# EAGLE design Car cover Main1 (EAGLE 7.6.0)
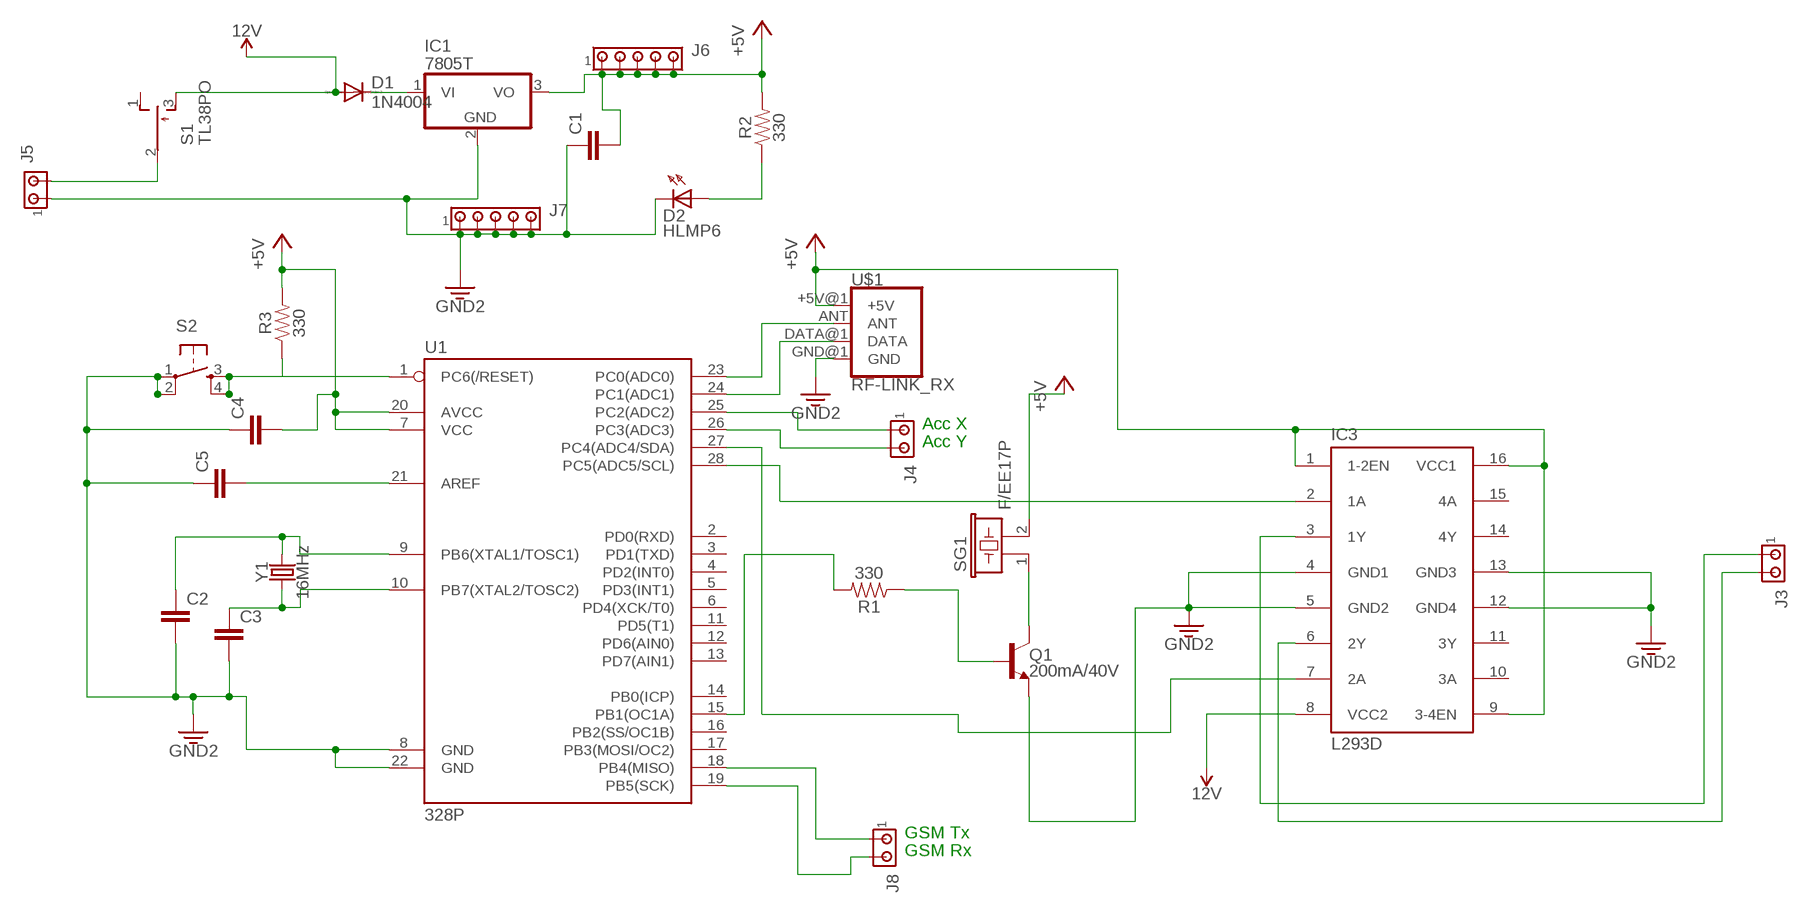
[diagram p0: schematic, sheet 1]

## Parts
C1  C5/2.5  [C5B2.5]
C2  C5/2.5  [C5B2.5]
C3  C5/2.5  [C5B2.5]
C4  C5/2.5  [C5B2.5]
C5  C5/2.5  [C5B2.5]
D1  1N4004  [DO41-10]
D2  HLMP6  [HLMP6]
IC1  7805T  [TO220H]
IC3  L293D  [DIL16]
J3  MTA02-156  [1X2MTA]
J4  MTA02-156  [1X2MTA]
J5  MTA02-156  [1X2MTA]
J6  MTA05-100  [10X05MTA]
J7  MTA05-100  [10X05MTA]
J8  MTA02-156  [1X2MTA]
Q1  200mA/40V  TRANS_NPN-2N3904  [TO-92]
R1  330  330OHM-HORIZ-1/10W-5%  [AXIAL-0.3]
R2  330  330OHM-HORIZ-1/10W-5%  [AXIAL-0.3]
R3  330  330OHM-HORIZ-1/10W-5%  [AXIAL-0.3]
S1  TL38PO  [TL3XPO]
S2  TAC_SWITCHPTH  [TACTILE-PTH]
SG1  F/EE17P  [F/EE17P]
U1  328P  ATMEGA328P_PDIP  [DIP28]
U$1  RF-LINK_RX  [RF-LINK_RX]
Y1  16MHz  CRYSTAL-16MHZPTH-HC49US  [HC49US]

## Nets
3.3V: C1.1 C2.2 C3.2 C4.1 C5.1 D2.K IC1.2(GND) IC3.4(GND1) IC3.5(GND2) IC3.12(GND4) IC3.13(GND3) J5.1 J7.1 J7.2 J7.3 J7.4 J7.5 Q1.1(E) S2.1 S2.2 U1.8(GND) U1.22(GND) U$1.GND@1(GND) ; supply symbol labelled GND2
12V: D1.A IC3.8(VCC2) S1.3(S)
+5V: C1.2 C4.2 IC1.3(VO) IC3.1(1-2EN) IC3.9(3-4EN) IC3.16(VCC1) J6.1 J6.2 J6.3 J6.4 J6.5 R2.P$2 R3.P$2 SG1.2 U1.7(VCC) U1.20(AVCC) U$1.+5V@1(+5V)
N$1: U1.23(PC0(ADC0)) U$1.ANT
N$2: J4.1 U1.25(PC2(ADC2))
N$3: J4.2 U1.26(PC3(ADC3))
N$4: J8.1 U1.18(PB4(MISO))
N$5: J8.2 U1.19(PB5(SCK))
N$6: IC3.2(1A) U1.28(PC5(ADC5/SCL))
N$7: D2.A R2.P$1
N$8: Q1.2(B) R1.P$1
N$9: IC3.7(2A) U1.27(PC4(ADC4/SDA))
N$10: R3.P$1 S2.3 S2.4 U1.1(PC6(/RESET))
N$11: C3.1 U1.10(PB7(XTAL2/TOSC2)) Y1.1
N$12: C5.2 U1.21(AREF)
N$13: IC3.3(1Y) J3.1
N$14: J5.2 S1.2(P)
N$15: IC3.6(2Y) J3.2
N$16: D1.C IC1.1(VI)
N$17: R1.P$2 U1.15(PB1(OC1A))
N$18: U1.24(PC1(ADC1)) U$1.DATA@1(DATA)
N$19: Q1.3(C) SG1.1
N$24: C2.1 U1.9(PB6(XTAL1/TOSC1)) Y1.2
Unconnected: IC3.10(3A) IC3.11(3Y) IC3.14(4Y) IC3.15(4A) S1.1(O) U1.2(PD0(RXD)) U1.3(PD1(TXD)) U1.4(PD2(INT0)) U1.5(PD3(INT1)) U1.6(PD4(XCK/T0)) U1.11(PD5(T1)) U1.12(PD6(AIN0)) U1.13(PD7(AIN1)) U1.14(PB0(ICP)) U1.16(PB2(SS/OC1B)) U1.17(PB3(MOSI/OC2))

## Notes on the sheet
- Acc X
- Acc Y
- GSM Tx
- GSM Rx

## Library data of the parts
C1-C5 = capacitor-wima:C: CAPACITOR naming: grid - package width
D1 = diode:1N4004: DIODE general purpose rectifier, 1 A
D2 = display-hp:HLMP6: LED 2mm horizontal; MF: AGILENT TECHNOLOGIES; MPN: HLMP-6500; OC_FARNELL: 1652490; OC_NEWARK: 40K0088
IC1 = linear:78*: Positive VOLTAGE REGULATOR Source: http://cache.national.com/ds/LM/LM78L05.pdf http://www.fairchildsemi.com/ds/LM/LM7805.pdf
IC3 = st-microelectronics:L293D: PUSH-PULL 4 CHANNEL DRIVER; MPN: L293D; OC_FARNELL: 9589619; OC_NEWARK: 56P8249
J3-J5 J8 = con-amp:MTA02-156: AMP connector
J6 J7 = con-amp:MTA05-100: AMP connector
Q1 = SparkFun-DiscreteSemi:TRANS_NPN: NPN transistor Current controlled devices typically used to amplify current or used as a switch. BC547 - COM-08928 <http://www.sparkfun.com/products/8928> (TO-92 45V 100mA) (1.Collector 2.Base 3.Emitter) 2N3904 - COM-00521 <http://www.sparkfun.com/products/521> (TO-92 40V 200mA) (1.Emitter 2.Base 3.Collector) P2N2222A - COM-12852 <http://www.sparkfun.com/products/12852> (TO-92 40V 600mA) (1.Collector 2.Base 3.Emitter); PROD_ID: TRANS-08447
R1-R3 = SparkFun-Resistors:330OHM: 330Ω resistor A resistor is a passive two-terminal electrical component that implements electrical resistance as a circuit element. Resistors act to reduce current flow, and, at the same time, act to lower voltage levels within circuits. - Wikipedia; PROD_ID: RES-8371
S1 = switch:TL38PO: TINY SWITCH ON OFF MOM Source: http://www2.produktinfo.conrad.com/datenblaetter/700000-724999/705152-da-01-de-Subminiaturschalter_TL_36YO.pdf
S2 = SparkFun-Retired:TAC_SWITCH: Momentary Switch Button commonly used for reset or general input. Spark Fun Electronics SKU : COM-00097 SMT- SWCH-08247
SG1 = buzzer:F/EE17P: BUZZER Source: Buerklin; OC_FARNELL: unknown; OC_NEWARK: unknown
U1 = SparkFun-IC-Microcontroller:ATMEGA328P_PDIP: Atmel 328P Through hole ATMEGA328P uC used in the Arduino 32kb flash, 1k EEPROM, 2k SRAM Datasheet <http://www.sparkfun.com/datasheets/Components/SMD/ATMega328.pdf> SparkFun Products Storefront component: AVR 28 Pin 20MHz 32K 6A/D - ATMega328P <https://www.sparkfun.com/products/9061> (COM-09061) SparkFun Simon Says - Through-Hole Soldering Kit <https://www.sparkfun.com/products/10547> (KIT-10547) SparkFun Learn to Solder - Simon Says <https://www.sparkfun.com/products/13708> (KIT-13708) SparkFun BigTime Watch Kit <https://www.sparkfun.com/products/11734> (KIT-11734) SparkFun ClockIt <https://www.sparkfun.com/products/10930> (KIT-10930) SparkFun Serial Enabled LCD Kit <https://www.sparkfun.com/products/10097> (LCD-10097) SparkFun Simon Tilts - Through Hole Soldering Kit <https://www.sparkfun.com/products/12634> (KIT-12634) SparkFun Frequency Counter Kit <https://www.sparkfun.com/products/10140> (KIT-10140) FabFM Radio Kit <https://www.sparkfun.com/products/11043> (KIT-11043) SparkFun Binary Blaster Kit <https://www.sparkfun.com/products/12037> (KIT-12037) SparkFun Metro-Gnome <https://www.sparkfun.com/products/9236> (KIT-09236) ATmega328 with Arduino Optiboot (Uno) <https://www.sparkfun.com/products/10524> (DEV-10524); PROD_ID: IC-09136
U$1 = SparkFun-RF:RF-LINK_RX: RF Link Receiver (434 MHz, 315 MHz) These wireless receivers work with equivalent transmitters. They can easily fit into a breadboard and work well with microcontrollers to create a very simple wireless data link. Since these are only receivers, they will only work communicating data one-way, you would need two pairs (of different frequencies) to act as a transmitter/receiver pair.. SparkFun Products RF Link Receiver - 4800bps (434 MHz) <https://www.sparkfun.com/products/10532>(WRL-10532); SF_ID: WRL-10533
Y1 = SparkFun-Clocks:CRYSTAL-16MHZ: 16MHz Crystal Digikey Example <http://www.digikey.com/product-search/en?keywords=535-9122-1-ND> Frequency: 16MHz Frequency Stability: ±50ppm Frequency Tolerance: ±20ppm Load Capacitance: 18pF SparkFun Products: Pro Micro -5V/16MHz <https://www.sparkfun.com/products/12640> SparkFun Serial Enabled LCD Kit <https://www.sparkfun.com/products/10097>; PROD_ID: XTAL-08181; SF_ID: COM-00536

## Board
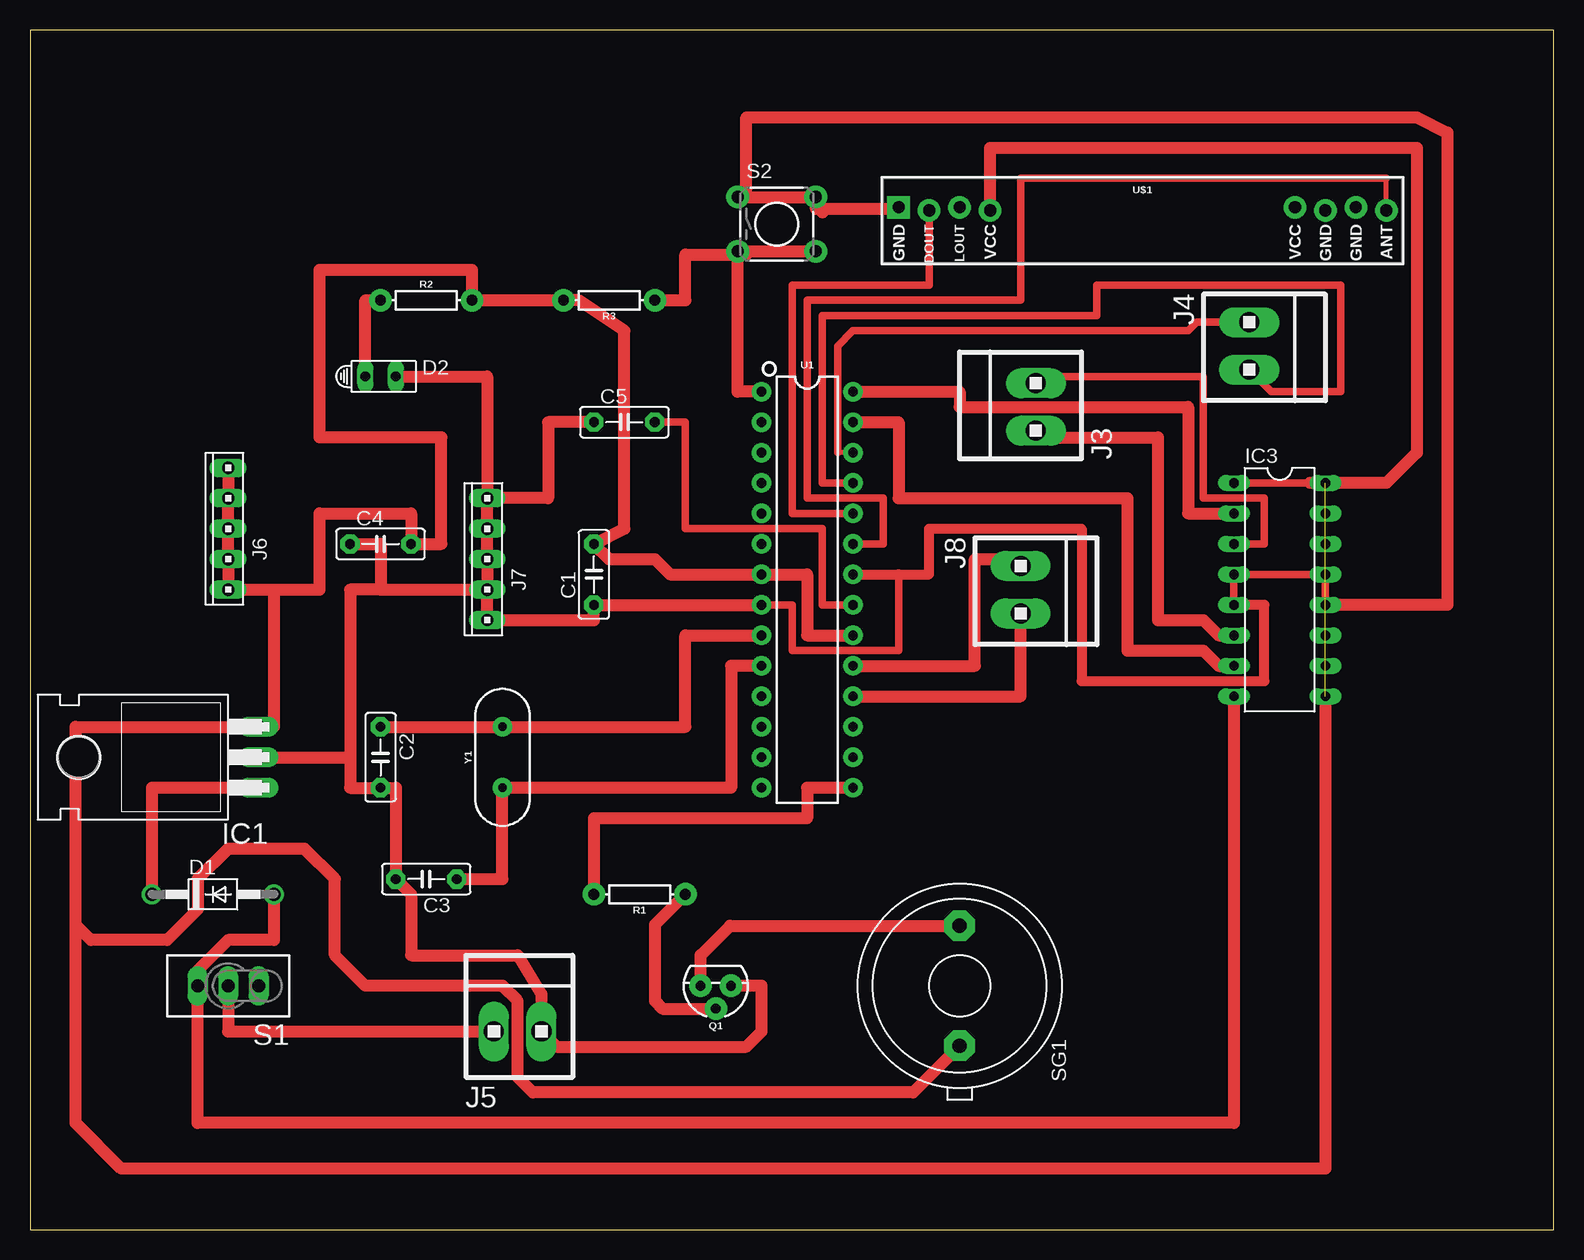
[diagram p1: board, top side]
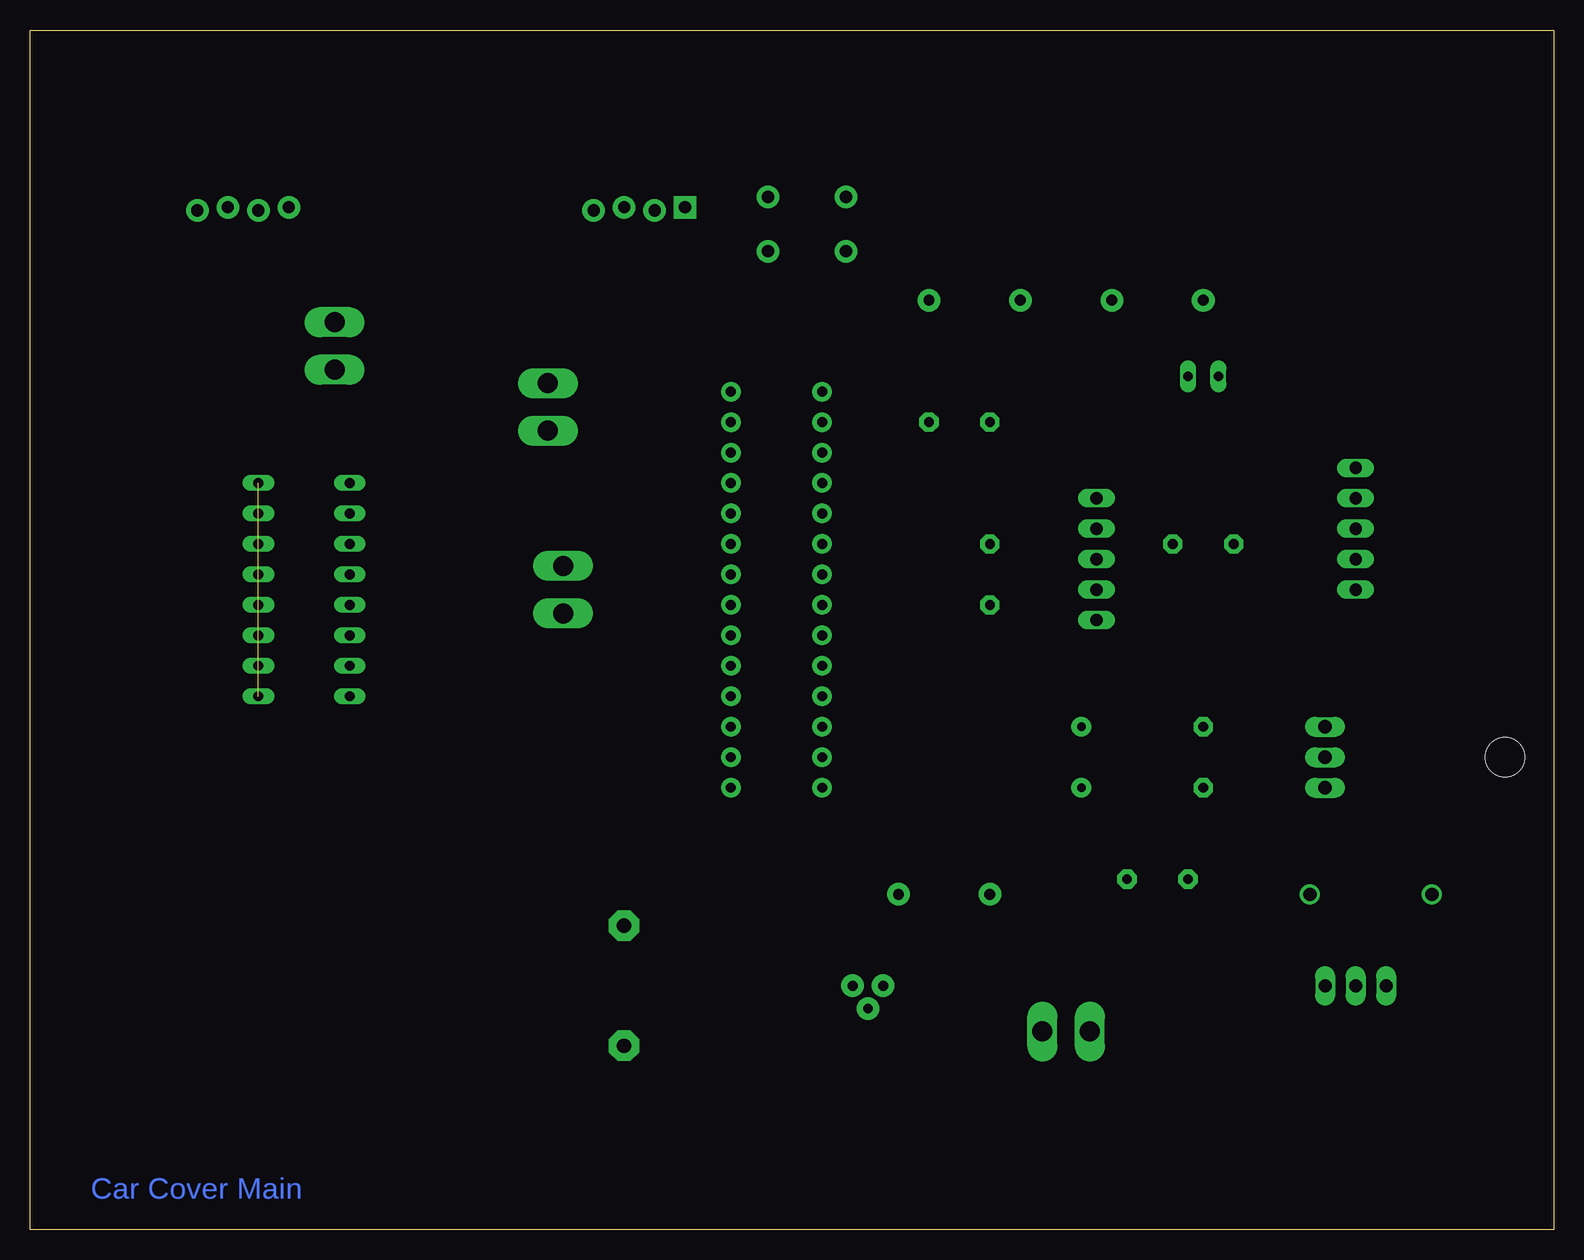
[diagram p2: board, bottom side, seen from below]

Size 126.98 x 100 mm. Coordinates in mm from the lower left corner, seen from the top.
Outline: 0,0 126.98,0 126.98,100 0,100 0,0
Copper layers (1*16): Top 0.035mm / dielectric 1.5mm / Bottom 0.035mm
Design rules "default": minimum track width 10mil, minimum drill 24mil, track to track 8mil, track to pad 8mil, pad to pad 8mil, via to via 8mil, smd to smd 8mil, copper to edge 40mil, drill to drill 8mil, minimum pad ring 10mil, minimum via ring 8mil, stop-mask expansion 4mil, vias tented up to drill 0mil, thermal gap 10mil

### Footprints (pad centres in the part's own frame; a part is rotated, then mirrored left to right if it is on the bottom)
C5B2.5 = drill 0.813 pad 1.6 octagon: 1 -2.54,0; 2 2.54,0
DO41-10 = drill 1.118: A 5.08,0; C -5.08,0
HLMP6 = drill 0.813 long: A -1.27,0; K 1.27,0
TO220H = drill 1.118 long: 1 -2.54,-10.16; 2 0,-10.16; 3 2.54,-10.16 | hole 3.302: 0,4.826
DIL16 = drill 0.813 long: 1 -8.89,-3.81; 2 -6.35,-3.81; 3 -3.81,-3.81; 4 -1.27,-3.81; 5 1.27,-3.81; 6 3.81,-3.81; 7 6.35,-3.81; 8 8.89,-3.81; 9 8.89,3.81; 10 6.35,3.81; 11 3.81,3.81; 12 1.27,3.81; 13 -1.27,3.81; 14 -3.81,3.81; 15 -6.35,3.81; 16 -8.89,3.81
1X2MTA = drill 1.676 long: 1 1.981,0; 2 -1.981,0
10X05MTA = drill 1.016 long: 1 5.08,0; 2 2.54,0; 3 0,0; 4 -2.54,0; 5 -5.08,0
TO-92 = drill 0.813 pad 1.88: 1 -1.27,0; 2 0,1.905; 3 1.27,0
AXIAL-0.3 = drill 0.9 pad 1.88: P$1 -3.81,0; P$2 3.81,0
TL3XPO = drill 1.1 pad 1.422 long: 1 -2.54,0; 2 0,0; 3 2.54,0
TACTILE-PTH = drill 1.016 pad 1.88: 1 -3.251,2.261; 2 3.251,2.261; 3 -3.251,-2.261; 4 3.251,-2.261
F/EE17P = drill 1.194 pad 2.54 octagon: 1 -5.004,0; 2 5.004,0
DIP28 = drill 0.813 pad 1.626: 1 -16.51,-3.81; 2 -13.97,-3.81; 3 -11.43,-3.81; 4 -8.89,-3.81; 5 -6.35,-3.81; 6 -3.81,-3.81; 7 -1.27,-3.81; 8 1.27,-3.81; 9 3.81,-3.81; 10 6.35,-3.81; 11 8.89,-3.81; 12 11.43,-3.81; 13 13.97,-3.81; 14 16.51,-3.81; 15 16.51,3.81; 16 13.97,3.81; 17 11.43,3.81; 18 8.89,3.81; 19 6.35,3.81; 20 3.81,3.81; 21 1.27,3.81; 22 -1.27,3.81; 23 -3.81,3.81; 24 -6.35,3.81; 25 -8.89,3.81; 26 -11.43,3.81; 27 -13.97,3.81; 28 -16.51,3.81
RF-LINK_RX = drill 1.016 pad 1.88: +5V@1 -12.7,-0.127; +5V@2 12.7,0.127; ANT 20.32,-0.127; DATA@1 -17.78,-0.127; DATA@2 -15.24,0.127; GND@2 15.24,-0.127; GND@3 17.78,0.127 | drill 1.016 pad 1.88 square: GND@1 -20.32,0.127
HC49US = drill 0.7 pad 1.651: 1 -2.54,0; 2 2.54,0

### Placement (x,y rotation side)
C1  46.99,54.61 90 top
C2  29.21,39.37 270 top
C3  33.02,29.21 180 top
C4  29.21,57.15 0 top
C5  49.53,67.31 0 top
D1  15.24,27.94 0 top
D2  29.21,71.12 0 top
IC1  8.89,39.37 90 top
IC3  104.14,53.34 270 top
J3  83.82,68.58 90 top
J4  101.6,73.66 270 top
J5  40.64,16.51 0 top
J6  16.51,58.42 90 top
J7  38.1,55.88 90 top
J8  82.55,53.34 270 top
Q1  57.15,20.32 180 top
R1  50.8,27.94 180 top
R2  33.02,77.47 0 top
R3  48.26,77.47 180 top
S1  16.51,20.32 180 top
S2  62.23,83.82 0 top
SG1  77.47,20.32 270 top
U1  64.77,53.34 270 top
U$1  92.71,85.09 0 top
Y1  39.37,39.37 90 top

### Tracks (layer width: path | path; a pad name or v marks a point on that pad's centre or on a via)
3.3V
  Top 0.61: IC3.5 IC3.4 IC3.13 IC3.12 | U1.8 63.5,52.07 63.5,48.26 72.39,48.26 72.39,54.61
  Top 0.813: U1.22 72.39,54.61 74.93,54.61 74.93,58.42 87.63,58.42 87.63,45.72 102.87,45.72 102.87,52.07 IC3.5
  Top 1.016: C4.1 29.21,57.15 29.21,53.34 | 29.21,53.34 J7.4 | J7.4 J7.5 46.99,50.8 C1.1 U1.8 | J7.4 J7.3 J7.2 J7.1 | IC1.2 26.67,39.37 | 26.67,39.37 26.67,36.83 C2.2 30.48,36.83 C3.2 31.75,27.94 31.75,22.86 40.64,22.86 42.62,19.61 J5.1 43.89,15.24 59.69,15.24 60.96,16.51 60.96,20.32 Q1.1 | 29.21,53.34 26.67,53.34 26.67,39.37 | D2.K 38.1,71.12 J7.1 | C5.1 43.18,67.31 43.18,60.96 J7.1 | S2.2 S2.1 59.69,86.79 59.69,92.71 115.57,92.71 118.11,91.44 118.11,52.07 IC3.12 | S2.2 66.04,84.81 66.04,85.09 | 66.04,85.09 65.48,85.09 S2.2 | 66.04,85.09 72.39,85.09 U$1.GND@1
12V
  Top 1.016: IC3.8 100.33,8.89 13.97,8.89 S1.3 13.97,21.59 16.51,24.13 20.32,24.13 D1.A
+5V  (1 unrouted)
  Top 0.61: IC3.1 106.68,62.23 IC3.16
  Top 1.016: J6.1 J6.2 J6.3 J6.4 J6.5 20.32,53.34 | 20.32,53.34 24.13,53.34 24.13,59.69 31.75,59.69 C4.2 34.29,57.15 34.29,66.04 24.13,66.04 24.13,80.01 36.83,80.01 R2.P$2 R3.P$2 45.72,77.47 49.53,74.93 49.53,58.42 C1.2 48.26,55.88 52.07,55.88 53.34,54.61 U1.7 64.77,54.61 64.77,49.53 U1.20 | 20.32,53.34 20.32,41.91 IC1.3 3.81,41.91 3.81,25.4 | SG1.2 73.58,11.43 41.91,11.43 40.64,12.7 40.64,19.05 39.37,20.32 27.94,20.32 25.4,22.86 25.4,29.21 22.86,31.75 16.51,31.75 13.97,29.21 13.97,26.67 11.43,24.13 5.08,24.13 3.81,25.4 | IC3.9 107.95,5.08 7.62,5.08 3.81,8.89 3.81,25.4 | U$1.+5V@1 80.01,90.17 115.57,90.17 115.57,64.77 113.03,62.23 106.68,62.23
N$1
  Top 0.406: U$1.ANT 113.03,87.63
  Top 0.61: U1.23 71.12,57.15 71.12,60.96 64.77,60.96 64.77,77.47 82.55,77.47 82.55,87.63 113.03,87.63
N$2
  Top 0.406: 101.6,71.12 J4.1
  Top 0.61: U1.25 66.04,62.23 66.04,76.2 88.9,76.2 88.9,78.74 109.22,78.74 109.22,69.85 103.43,69.85 J4.1
N$3
  Top 0.406: U1.26 67.31,64.77 | 102.87,76.2 102.87,74.93 101.6,74.93 J4.2
  Top 0.61: 67.31,64.77 67.31,73.66 68.58,74.93 96.52,74.93 97.23,75.64 J4.2
N$4
  Top 1.016: U1.18 82.55,44.45 J8.1
N$5
  Top 1.016: U1.19 78.74,46.99 78.74,55.88 82.55,55.88 J8.2
N$6
  Top 1.016: U1.28 77.47,69.85 77.47,68.58 96.52,68.58 96.52,59.69 IC3.2
N$7
  Top 1.016: D2.A 27.94,77.47 R2.P$1
N$8
  Top 1.016: R1.P$1 52.07,25.4 52.07,19.05 52.7,18.41 Q1.2
N$9
  Top 1.016: U1.27 72.39,67.31 72.39,60.96 91.44,60.96 91.44,48.26 97.79,48.26 99.06,46.99 IC3.7
N$10
  Top 1.016: U1.1 58.98,69.85 S2.3 | R3.P$1 54.61,77.47 54.61,81.28 58.98,81.28 | 59.69,81.28 58.98,81.28 | 58.98,81.28 S2.3 | S2.3 S2.4
N$11
  Top 1.016: C3.1 39.37,29.21 Y1.1 58.42,36.83 58.42,46.99 U1.10
N$12
  Top 0.61: U1.21 66.04,52.07 66.04,58.42 54.61,58.42 54.61,67.31 C5.2
N$13
  Top 0.406: 83.82,71.12 J3.1
  Top 0.61: 83.82,71.12 97.79,71.12 97.79,60.96 102.87,60.96 102.87,57.15 IC3.3
N$14
  Top 1.016: S1.2 16.51,16.51 J5.2
N$15
  Top 1.016: J3.2 84.38,66.04 93.98,66.04 93.98,50.8 97.79,50.8 99.06,49.53 IC3.6
N$16
  Top 1.016: IC1.1 10.16,36.83 D1.C
N$17
  Top 1.016: U1.15 64.77,36.83 64.77,34.29 46.99,34.29 R1.P$2
N$18
  Top 0.61: U$1.DATA@1 74.93,78.74 63.5,78.74 63.5,59.69 U1.24
N$19
  Top 1.016: Q1.3 55.88,22.86 58.34,25.32 SG1.1
N$24
  Top 1.016: C2.1 Y1.2 54.61,41.91 54.61,49.53 U1.9

### Text on the board
Bottom: Car Cover Main